# Altium schematic sheet 自动加料控制系统原理图.SchDoc
size A4
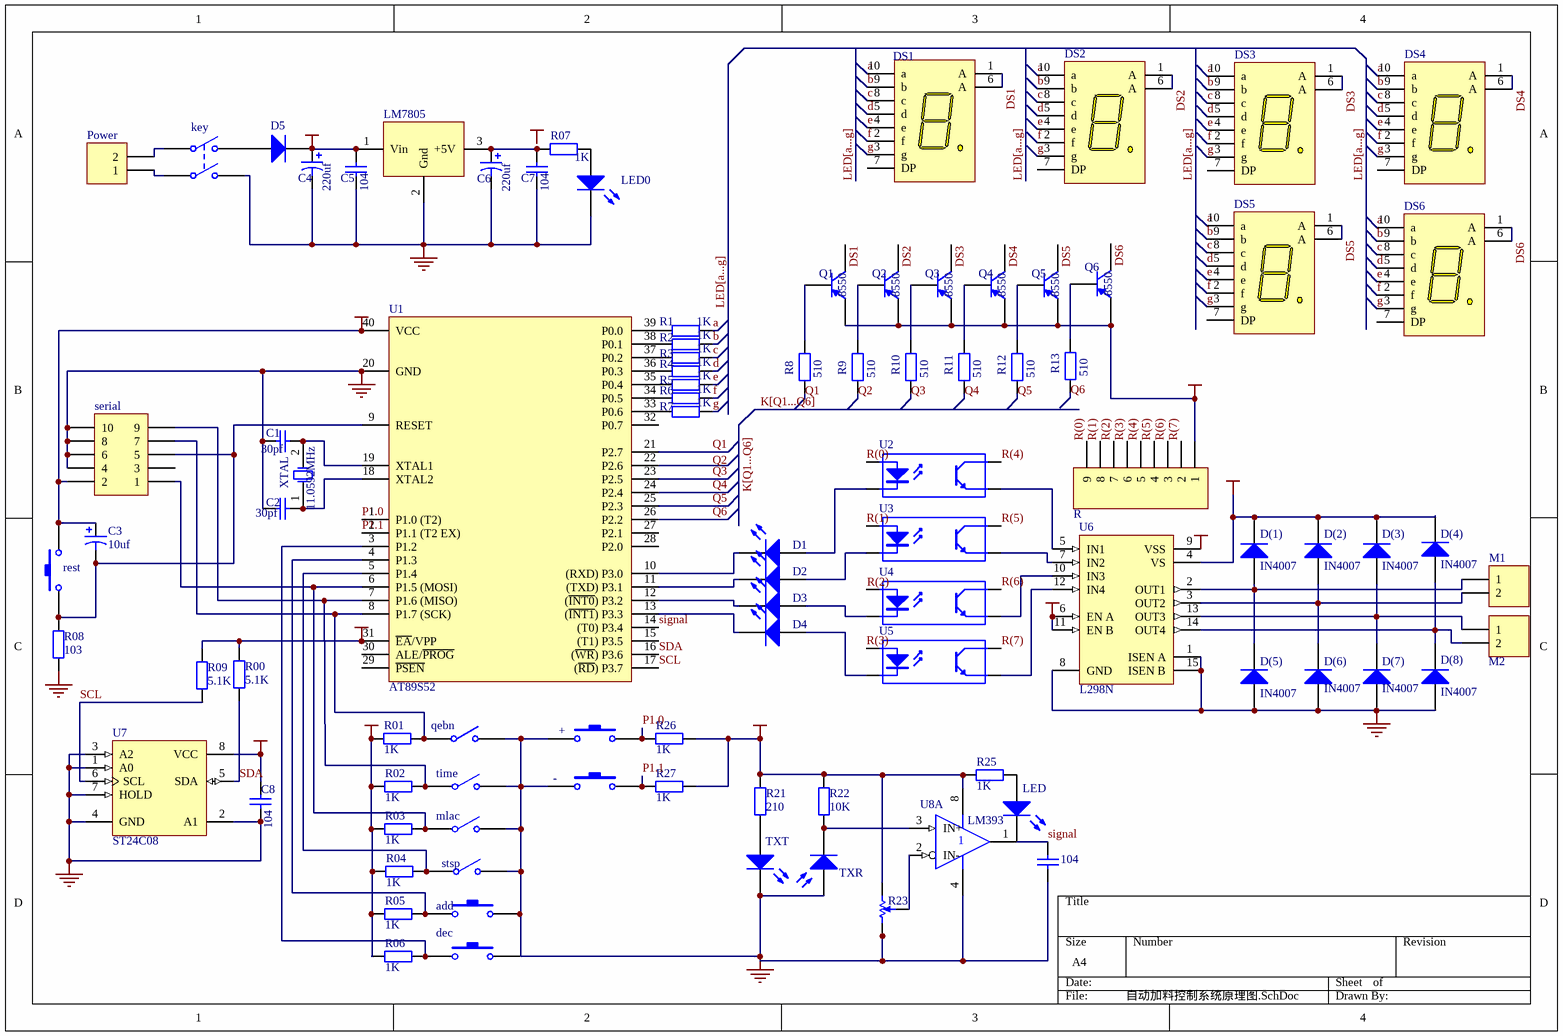
[diagram p0: 自动加料控制系统原理图.SchDoc]

## Parts
11.0592MHz  XTAL  [R38]
104  Cap  [RAD-0.3]  (value not drawn)
+  SW-PB  [SPST-2]  (value not drawn)
-  SW-PB  [SPST-2]  (value not drawn)
add  SW-PB  [SPST-2]  (value not drawn)
C1  value 30pf  [RAD-0.3]  (hidden comment: Cap)
C2  value 30pf  [RAD-0.3]  (hidden comment: Cap)
C3  value 10uf  [RB7.6-15]  (hidden comment: Cap Pol1)
C4  value 220uf  [RB7.6-15]  (hidden comment: Cap Pol1)
C5  value 104  [RAD-0.3]  (hidden comment: Cap)
C6  value 220uf  [RB7.6-15]  (hidden comment: Cap Pol1)
C7  value 104  [RAD-0.3]  (hidden comment: Cap)
C8  value 104  [C1206]  (hidden comment: Cap Semi)
D1  LED0  [LED-0]  (value not drawn)
D2  LED0  [LED-0]  (value not drawn)
D3  LED0  [LED-0]  (value not drawn)
D4  LED0  [LED-0]  (value not drawn)
D5  Diode BAS21  [SOT-23]  (value not drawn)
D(1)  IN4007  [DO-201AD]
D(2)  IN4007  [DO-201AD]
D(3)  IN4007  [DO-201AD]
D(4)  IN4007  [DO-201AD]
D(5)  IN4007  [DO-201AD]
D(6)  IN4007  [DO-201AD]
D(7)  IN4007  [DO-201AD]
D(8)  IN4007  [DO-201AD]
dec  SW-PB  [SPST-2]  (value not drawn)
DS1  Dpy Yellow-CA  [LEDDIP-10]  (value not drawn)
DS2  Dpy Yellow-CA  [LEDDIP-10]  (value not drawn)
DS3  Dpy Yellow-CA  [LEDDIP-10]  (value not drawn)
DS4  Dpy Yellow-CA  [LEDDIP-10]  (value not drawn)
DS5  Dpy Yellow-CA  [LEDDIP-10]  (value not drawn)
DS6  Dpy Yellow-CA  [LEDDIP-10]  (value not drawn)
key  SW-DPST  [DPST-4]  (value not drawn)
LED  LED0  [3.5X2.8X1.9]  (value not drawn)
LED0  LED0  [LED-0]  (value not drawn)
LM7805  LM7805CT  [TO-220]  (value not drawn)
M1  Header 2H  [HDR1X2H]  (value not drawn)
M2  Header 2H  [HDR1X2H]  (value not drawn)
mlac  SW-SPST  [SPST-2]  (value not drawn)
Power  MHDR1X2  [MHDR1X2]  (value not drawn)
Q1  8550  [TO-92A]
Q2  8550  [TO-92A]
Q3  8550  [TO-92A]
Q4  8550  [TO-92A]
Q5  8550  [TO-92A]
Q6  8550  [TO-92A]
qebn  SW-SPST  [SPST-2]  (value not drawn)
R  Header 9H  [HDR1X9H]  (value not drawn)
R00  value 5.1K  [AXIAL-0.4]  (hidden comment: Res2)
R1  value 1K  [AXIAL-0.4]  (hidden comment: Res2)
R01  value 1K  [AXIAL-0.4]  (hidden comment: Res2)
R2  value 1K  [AXIAL-0.4]  (hidden comment: Res2)
R02  value 1K  [AXIAL-0.4]  (hidden comment: Res2)
R3  value 1K  [AXIAL-0.4]  (hidden comment: Res2)
R03  value 1K  [AXIAL-0.4]  (hidden comment: Res2)
R4  value 1K  [AXIAL-0.4]  (hidden comment: Res2)
R04  value 1K  [AXIAL-0.4]  (hidden comment: Res2)
R5  value 1K  [AXIAL-0.4]  (hidden comment: Res2)
R05  value 1K  [AXIAL-0.4]  (hidden comment: Res2)
R6  value 1K  [AXIAL-0.4]  (hidden comment: Res2)
R06  value 1K  [AXIAL-0.4]  (hidden comment: Res2)
R7  value 1K  [AXIAL-0.4]  (hidden comment: Res2)
R07  value 1K  [AXIAL-0.4]  (hidden comment: Res2)
R8  value 510  [AXIAL-0.4]  (hidden comment: Res2)
R08  value 103  [AXIAL-0.4]  (hidden comment: Res2)
R9  value 510  [AXIAL-0.4]  (hidden comment: Res2)
R09  value 5.1K  [AXIAL-0.4]  (hidden comment: Res2)
R10  value 510  [AXIAL-0.4]  (hidden comment: Res2)
R11  value 510  [AXIAL-0.4]  (hidden comment: Res2)
R12  value 510  [AXIAL-0.4]  (hidden comment: Res2)
R13  value 510  [AXIAL-0.4]  (hidden comment: Res2)
R21  value 210  [AXIAL-0.4]  (hidden comment: Res2)
R22  value 10K  [AXIAL-0.4]  (hidden comment: Res2)
R23  RPot SM  [POT4MM-2]  (value not drawn)
R25  value 1K  [AXIAL-0.4]  (hidden comment: Res2)
R26  value 1K  [AXIAL-0.4]  (hidden comment: Res2)
R27  value 1K  [AXIAL-0.4]  (hidden comment: Res2)
rest  SW-PB  [SPST-2]  (value not drawn)
serial  Header 5X2  [HDR2X5]  (value not drawn)
stsp  SW-SPST  [SPST-2]  (value not drawn)
time  SW-SPST  [SPST-2]  (value not drawn)
TXR  JX-359-403W  [PIN2]  (value not drawn)
TXT  JX-359-403W  [3.5X2.8X1.9]  (value not drawn)
U1  AT89S52  [ADA(DIP-40/600)]
U2  Optoisolator1  [DIP-4]  (value not drawn)
U3  Optoisolator1  [DIP-4]  (value not drawn)
U4  Optoisolator1  [DIP-4]  (value not drawn)
U5  Optoisolator1  [DIP-4]  (value not drawn)
U6  L298N  [Multiwatt15H]
U7  ST24C08  [PSDIP8A]
U8  LM393  [SO-G8/E2.5]  (part A of 2)

## Nets
5V: C3.1 Q1.1(E) Q2.1(E) Q3.1(E) Q4.1(E) Q5.1(E) Q6.1(E) R.1 R00.1 R01.2 R02.2 R03.2 R04.2 R05.2 R06.2 R09.2 R21.1 R22.1 R23.CW(+) R25.1 R26.1 R27.1 rest.1 serial.2 U1.31(~{EA}/VPP) U1.40(VCC) U6.6(EN_A) U6.9(VSS) U6.11(EN_B) U8.8(VCC)
12V: C4.1 C5.2 D5.3(K) D(1).2(K) D(2).2(K) D(3).2(K) D(4).2(K) LM7805.1(Vin) U6.4(VS)
GND: 104.1 +.2 -.2 C1.1 C2.1 C4.2 C5.1 C6.2 C7.1 C8.1 D(5).1(A) D(6).1(A) D(7).1(A) D(8).1(A) key.4(NO2) LED0.2(K) LM7805.2(Gnd) mlac.2(NO) qebn.2(NO) R08.2 R23.CCW(-) serial.4 serial.6 serial.8 serial.10 stsp.2(NO) time.2(NO) TXR.1(A) TXT.2(K) U1.20(GND) U6.1(ISEN_A) U6.8(GND) U6.15(ISEN_B) U7.1(A0) U7.2(A1) U7.3(A2) U7.4(GND) U7.7(HOLD) U8.4(GND)
VCC: C8.2 U7.8(VCC)
a: DS1.10(a) DS2.10(a) DS3.10(a) DS4.10(a) DS5.10(a) DS6.10(a) R1.2
b: DS1.9(b) DS2.9(b) DS3.9(b) DS4.9(b) DS5.9(b) DS6.9(b) R2.2
c: DS1.8(c) DS2.8(c) DS3.8(c) DS4.8(c) DS5.8(c) DS6.8(c) R3.2
d: DS1.5(d) DS2.5(d) DS3.5(d) DS4.5(d) DS5.5(d) DS6.5(d) R4.2
DS1: DS1.1(A) DS1.6(A) Q1.3(C)
DS2: DS2.1(A) DS2.6(A) Q2.3(C)
DS3: DS3.1(A) DS3.6(A) Q3.3(C)
DS4: DS4.1(A) DS4.6(A) Q4.3(C)
DS5: DS5.1(A) DS5.6(A) Q5.3(C)
DS6: DS6.1(A) DS6.6(A) Q6.3(C)
e: DS1.4(e) DS2.4(e) DS3.4(e) DS4.4(e) DS5.4(e) DS6.4(e) R5.2
f: DS1.2(f) DS2.2(f) DS3.2(f) DS4.2(f) DS5.2(f) DS6.2(f) R6.2
g: DS1.3(g) DS2.3(g) DS3.3(g) DS4.3(g) DS5.3(g) DS6.3(g) R7.2
P1.0: +.1 R26.2 U1.1(P1.0_(T2))
P1.1: -.1 R27.2 U1.2(P1.1_(T2_EX))
Q1: R8.1 U1.21(P2.7)
Q2: R9.1
Q3: R10.1 U1.23(P2.5)
Q4: R11.1 U1.24(P2.4)
Q5: R12.1 U1.25(P2.3)
Q6: R13.1 U1.26(P2.2)
R(0): R.9 U2.1(A)
R(1): R.8 U3.1(A)
R(2): R.7
R(3): R.6 U5.1(A)
R(4): R.5 U2.4(C)
R(5): R.4 U3.4(C)
R(6): R.3 U4.4(C)
R(7): R.2 U5.4(C)
SCL: R09.1 U1.17((~{RD})_P3.7) U7.6(SCL)
SDA: R00.2 U1.16((~{WR})_P3.6) U7.5(SDA)
signal: 104.2 U1.14((T0)_P3.4) U8.1(OUT)
Net11.0592MHz_1: 11.0592MHz.1(OSC1) C2.2 U1.18(XTAL2)
Net11.0592MHz_2: 11.0592MHz.2(OSC2) C1.2 U1.19(XTAL1)
Netadd_2: add.2 R05.1 U1.4(P1.3)
NetC3_2: C3.2 R08.1 rest.2 serial.5 U1.9(RESET)
NetC6_1: C6.1 C7.2 LM7805.3(+5V) R07.2
NetD1_1: D1.1(A) U2.2(K)
NetD1_2: D1.2(K) U1.10((RXD)_P3.0)
NetD2_1: D2.1(A) U3.2(K)
NetD2_2: D2.2(K) U1.11((TXD)_P3.1)
NetD3_1: D3.1(A) U4.2(K)
NetD3_2: D3.2(K) U1.12((~{INT0})_P3.2)
NetD4_1: D4.1(A) U5.2(K)
NetD4_2: D4.2(K) U1.13((~{INT1})_P3.3)
NetD5_1: D5.1(A) key.2(NO1)
NetD(1)_1: D(1).1(A) D(5).2(K) M1.1 U6.2(OUT1)
NetD(2)_1: D(2).1(A) D(6).2(K) M1.2 U6.3(OUT2)
NetD(3)_1: D(3).1(A) D(7).2(K) M2.1 U6.13(OUT3)
NetD(4)_1: D(4).1(A) D(8).2(K) M2.2 U6.14(OUT4)
Netdec_2: dec.2 R06.1 U1.3(P1.2)
Netkey_1: key.1(COMMON1) Power.2
Netkey_3: key.3(COMMON2) Power.1
NetLED0_1: LED0.1(A) R07.1
NetLED_1: LED.1(A) R25.2
Netmlac_1: mlac.1(COMMON) R03.1 serial.1 U1.6(P1.5_(MOSI))
NetQ1_2: Q1.2(B) R8.2
NetQ2_2: Q2.2(B) R9.2
NetQ3_2: Q3.2(B) R10.2
NetQ4_2: Q4.2(B) R11.2
NetQ5_2: Q5.2(B) R12.2
NetQ6_2: Q6.2(B) R13.2
Netqebn_1: qebn.1(COMMON) R01.1 serial.7 U1.8(P1.7_(SCK))
NetR1_1: R1.1 U1.39(P0.0)
NetR2_1: R2.1 U1.38(P0.1)
NetR02_1: R02.1 serial.9 time.1(COMMON) U1.7(P1.6_(MISO))
NetR3_1: R3.1 U1.37(P0.2)
NetR4_1: R4.1 U1.36(P0.3)
NetR04_1: R04.1 stsp.1(COMMON) U1.5(P1.4)
NetR5_1: R5.1 U1.35(P0.4)
NetR6_1: R6.1 U1.34(P0.5)
NetR7_1: R7.1 U1.33(P0.6)
NetR21_2: R21.2 TXT.1(A)
NetR22_2: R22.2 TXR.2(K) U8.3(IN+)
NetR23_W: R23.W U8.2(IN-)
NetU2_3: U2.3(E) U6.5(IN1)
NetU3_3: U3.3(E) U6.7(IN2)
NetU4_3: U4.3(E) U6.10(IN3)
NetU5_3: U5.3(E) U6.12(IN4)

Not connected (* = marked no-connect by the designer): add 1; dec 1; DS1 7(DP); DS2 7(DP); DS3 7(DP); DS4 7(DP); DS5 7(DP); DS6 7(DP); LED 2(K); serial 3; U1 15((T1)_P3.5) 22(P2.6) 27(P2.1) 28(P2.0) 29(~{PSEN}) 30(ALE/~{PROG}) 32(P0.7); U4 1(A)

## Buses and harness runs
bus K[Q1...Q6]
bus LED[a...g]

## Notes on the sheet
- Labels drawn without touching a wire or pin: 5V, Q2, R(2)

## Library data of the parts
11.0592MHz = XTAL: Crystal Oscillator; Published: 8-Jun-2000; LatestRevisionDate: 17-Jul-2002; LatestRevisionNote: Re-released for DXP Platform.; PackageReference: R38; Publisher: Altium Limited
104 = Cap: Capacitor; Value: 104; Published: 8-Jun-2000; LatestRevisionDate: 17-Jul-2002; LatestRevisionNote: Re-released for DXP Platform.; Publisher: Altium Limited
+ - add dec rest = SW-PB: Switch; Published: 24-Mar-1999; LatestRevisionDate: 17-Jul-2002; LatestRevisionNote: Re-released for DXP Platform.; PackageReference: SPST-2; Publisher: Altium Limited
C1 C2 C5 C7 = Cap: Capacitor; Published: 8-Jun-2000; LatestRevisionDate: 17-Jul-2002; LatestRevisionNote: Re-released for DXP Platform.; PackageReference: RAD-0.3; Publisher: Altium Limited
C3 C4 C6 = Cap Pol1: Polarized Capacitor (Radial); Published: 8-Jun-2000; LatestRevisionDate: 17-Jul-2002; LatestRevisionNote: Re-released for DXP Platform.; PackageReference: RB7.6-15; Publisher: Altium Limited
C8 = Cap Semi: Capacitor (Semiconductor SIM Model); Published: 8-Jun-2000; LatestRevisionDate: 17-Jul-2002; LatestRevisionNote: Re-released for DXP Platform.; PackageReference: C1206; Publisher: Altium Limited
D1-D4 LED0 = LED0: Typical INFRARED GaAs LED; Published: 8-Jun-2000; LatestRevisionDate: 08-Jul-2005; LatestRevisionNote: Mech Layer 1 removed.; PackageReference: LED-0; Publisher: Altium Limited
D5 = Diode BAS21: Silicon Switching Diode for High-Speed, High-Voltage Switching; Note: Pin 2 is not connected and not drawn.; Published: 21-Mar-2003; DatasheetDocument: Oct-1999; PackageDocument: Sep-2001; PackageReference: SOT-23; Publisher: Altium Limited; ComponentLink1Description: Manufacturer Link; ComponentLink1URL: http://www.infineon.com/; ComponentLink2Description: Datasheet; ComponentLink2URL: http://www.infineon.com/upload/Document/cmc_upload/documents/080/812/bas21series.pdf
D(1) D(2) D(3) D(4) D(5) D(6) D(7) D(8) = Diode 1N5407: 3 Amp Medium Power Silicon Rectifier Diode; Published: 8-Jun-2000; LatestRevisionDate: 17-Jul-2002; LatestRevisionNote: Re-released for DXP Platform.; DatasheetDocument: Aug-1984; PackageReference: DO-201AD; Publisher: Altium Limited; ComponentLink1Description: Manufacturer Link; ComponentLink1URL: http://www.irf.com/
DS1-DS6 = Dpy Yellow-CA: 7.6 mm Micro Bright Yellow 7-Segment Display: CA, RH DP; MinimumIntensity: 225 ucd; Note: IF = 5 mA; Note: Pins 1 and 6 are redundant Anodes.; Published: 8-Jun-2000; LatestRevisionDate: 17-Dec-2003; LatestRevisionNote: Schematic revised, PCB Footprint replaced.; DatasheetDocument: 11-Feb-2002; PackageDocument: 19-Feb-2002; PackageReference: LEDDIP-10; Publisher: Altium Limited; Colour: Yellow; ComponentLink1Description: Manufacturer Link; ComponentLink1URL: http://www.agilent.com/
key = SW-DPST: Double-Pole, Single-Throw Switch; Published: 24-Mar-1999; LatestRevisionDate: 17-Jul-2002; LatestRevisionNote: Re-released for DXP Platform.; PackageReference: DPST-4; Publisher: Altium Limited
LED TXT = LED3: Typical BLUE SiC LED; Published: 8-Jun-2000; LatestRevisionDate: 17-Dec-2003; LatestRevisionNote: PCB Footprint replaced.; DatasheetDocument: 16-Apr-2002; PackageDocument: 16-Apr-2002; PackageReference: 3.5X2.8X1.9; Publisher: Altium Limited
M1 M2 = Header 2H: Header, 2-Pin, Right Angle; LatestRevisionDate: 17-Jul-2002; LatestRevisionNote: Re-released for DXP Platform.; Publisher: Altium Limited
mlac qebn stsp time = SW-SPST: Single-Pole, Single-Throw Switch; Published: 24-Mar-1999; LatestRevisionDate: 17-Jul-2002; LatestRevisionNote: Re-released for DXP Platform.; PackageReference: SPST-2; Publisher: Altium Limited
Power = MHDR1X2: Header, 2-Pin; LatestRevisionDate: 17-Jul-2002; LatestRevisionNote: Re-released for DXP Platform.; Publisher: Altium Limited
Q1-Q6 = 2N3906: PNP General Purpose Amplifier; Published: 8-Jun-2000; LatestRevisionDate: 15-Jan-2003; LatestRevisionNote: PCB Footprint 'BCY-W3/D4.7' replaced; DatasheetDocument: 1997; PackageDocument: Sep-1998; PackageReference: TO-92A; Publisher: Altium Limited; Code_JEDEC: TO-92A; ComponentLink1Description: Manufacturer Link; ComponentLink1URL: http://www.fairchildsemi.com/; ComponentLink2Description: Datasheet; ComponentLink2URL: http://www.fairchildsemi.com/ds/2N%2F2N3906.pdf
R = Header 9H: Header, 9-Pin, Right Angle; LatestRevisionDate: 17-Jul-2002; LatestRevisionNote: Re-released for DXP Platform.; Publisher: Altium Limited
R00 R1 R01 R2 R02 R3 R03 R4 R04 R5 R05 R6 R06 R7 R07 R8 R08 R9 R09-R13 R21 R22 R25-R27 = Res2: Resistor; Published: 8-Jun-2000; LatestRevisionDate: 17-Jul-2002; LatestRevisionNote: Re-released for DXP Platform.; PackageReference: AXIAL-0.4; Publisher: Altium Limited
R23 = RPot SM: Square Trimming Potentiometer; Published: 17-Dec-2003; DatasheetDocument: Oct-2003; Publisher: Altium Limited
serial = Header 5X2: Header, 5-Pin, Dual row; LatestRevisionDate: 17-Jul-2002; LatestRevisionNote: Re-released for DXP Platform.; Publisher: Altium Limited
TXR = Photo Sen: Photosensitive Diode; Published: 24-Mar-1999; LatestRevisionDate: 17-Jul-2002; LatestRevisionNote: Re-released for DXP Platform.; PackageReference: PIN2; Publisher: Altium Limited
U1 = AT89S52-P: 8 位微处理器/40引脚; 子类别: 微处理器; 发布者: 磊元工作室; 发布日期: 2003年8月18日; 制造商: Atmel Corporation; 类别: 集成电路; 元件名称（国标）: 8 位微处理器; 元件名称（英文）: 8-bit Microcontroller; 特性:存储器容量: Flash：8KB  ，RAM：256B; 特性:定时器/计数器: 3 个 16-bit
U2-U5 = Optoisolator1: 4-Pin Phototransistor Optocoupler; Published: 24-Mar-1999; LatestRevisionDate: 04-Mar-2005; LatestRevisionNote: Sch pins 3 & 4 Swapped.; DatasheetDocument: Nov-2003; PackageReference: DIP-4; Publisher: Altium Limited
U6 = L298N: Dual Full Bridge Driver; Published: 8-Jun-2000; LatestRevisionDate: 17-Jul-2002; LatestRevisionNote: Re-released for DXP Platform.; DatasheetDocument: Jul-1999; PackageDocument: Apr-1998; PackageReference: Multiwatt15H; Publisher: Altium Limited; ComponentLink1Description: Manufacturer Link; ComponentLink1URL: http://www.st.com/
U7 = ST24C08RB3: Serial 8K (1K x 8) EEPROM; Published: 24-Aug-2001; LatestRevisionDate: 6-Jun-2005; LatestRevisionNote: Stylized 3D Model Added.; DatasheetDocument: Jul-1996; PackageDocument: Jun-1998; PackageReference: PSDIP8A; Publisher: Altium Limited; ComponentLink1Description: Manufacturer Link; ComponentLink1URL: http://www.st.com/
U8 = LM393D: Dual Differential Comparator; Manufacturer: Texas Instruments; Package Information: Latest Revision: Jan-1998; Class I: Logic; Published: 15-Apr-2002; Datasheet: Linear Circuits Data Book 1989 Volume 1 (Nov-1988); Package Reference: D008; Publisher: Altium Limited; Class II: Comparator